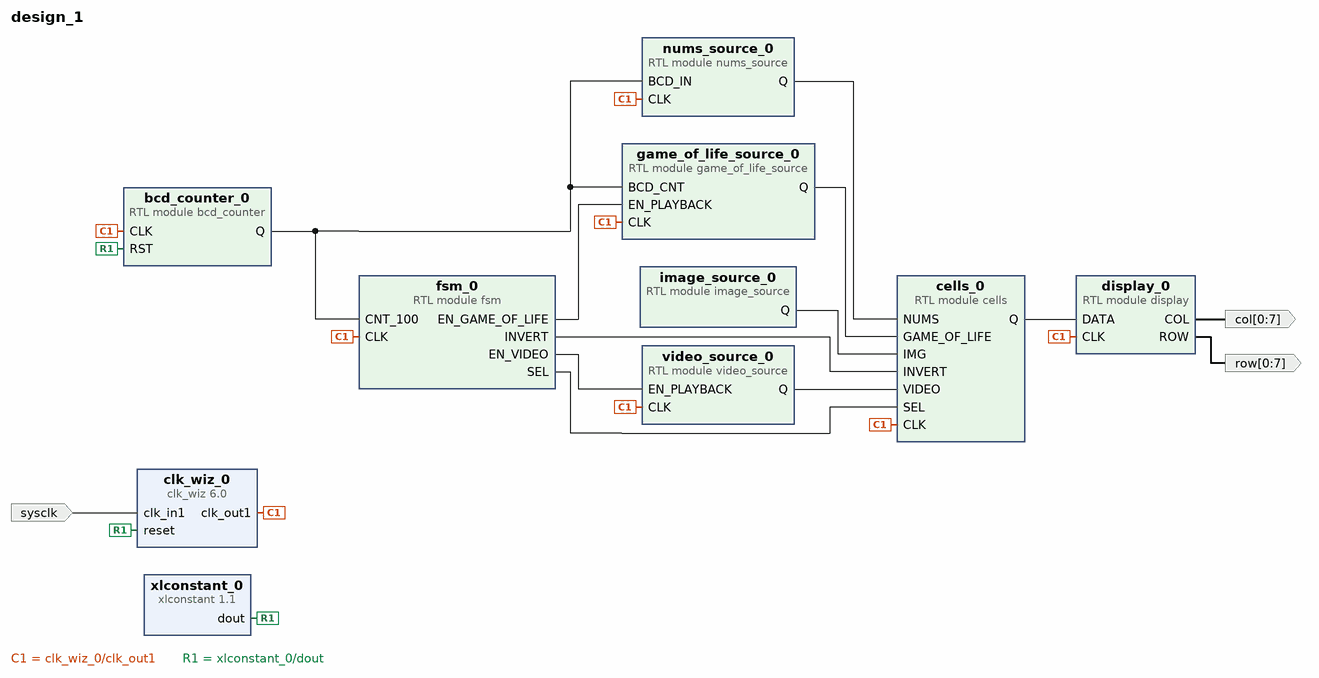
[diagram p0: block diagram of the top level]
# Vivado block design design_1, xc7z020clg400-1, Vivado 2023.2.2
create_bd_design design_1

create_bd_port -dir O -from 0 -to 7 row
create_bd_port -dir O -from 0 -to 7 col
create_bd_port -dir I -type clk sysclk
set_property -dict {CONFIG.FREQ_HZ 20000000} [get_bd_ports sysclk]

create_bd_cell -type ip -vlnv xilinx.com:ip:clk_wiz:6.0 clk_wiz_0
set_property -dict [list \
  CONFIG.CLKIN1_JITTER_PS 500.0 \
  CONFIG.CLKOUT1_JITTER 353.847 \
  CONFIG.CLKOUT1_PHASE_ERROR 301.005 \
  CONFIG.CLKOUT1_REQUESTED_OUT_FREQ 25.00 \
  CONFIG.MMCM_CLKFBOUT_MULT_F 50.000 \
  CONFIG.MMCM_CLKIN1_PERIOD 50.000 \
  CONFIG.MMCM_CLKIN2_PERIOD 10.0 \
  CONFIG.MMCM_CLKOUT0_DIVIDE_F 40.000 \
  CONFIG.PRIM_IN_FREQ 20.00 \
] [get_bd_cells clk_wiz_0]
create_bd_cell -type module -reference display display_0
create_bd_cell -type module -reference cells cells_0
create_bd_cell -type module -reference fsm fsm_0
create_bd_cell -type module -reference bcd_counter bcd_counter_0
create_bd_cell -type module -reference image_source image_source_0
create_bd_cell -type module -reference nums_source nums_source_0
create_bd_cell -type module -reference video_source video_source_0
create_bd_cell -type ip -vlnv xilinx.com:ip:xlconstant:1.1 xlconstant_0
set_property -dict {CONFIG.CONST_VAL 0} [get_bd_cells xlconstant_0]
create_bd_cell -type module -reference game_of_life_source game_of_life_source_0

# ---- connections ----

connect_bd_net [get_bd_pins bcd_counter_0/Q] \
  [get_bd_pins nums_source_0/BCD_IN] [get_bd_pins game_of_life_source_0/BCD_CNT] [get_bd_pins fsm_0/CNT_100]
connect_bd_net [get_bd_pins cells_0/Q] [get_bd_pins display_0/DATA]
connect_bd_net -net clk_in1_0_1 [get_bd_ports sysclk] [get_bd_pins clk_wiz_0/clk_in1]
connect_bd_net [get_bd_pins clk_wiz_0/clk_out1] \
  [get_bd_pins display_0/CLK] [get_bd_pins nums_source_0/CLK] [get_bd_pins video_source_0/CLK] [get_bd_pins cells_0/CLK] \
  [get_bd_pins bcd_counter_0/CLK] [get_bd_pins game_of_life_source_0/CLK] [get_bd_pins fsm_0/CLK]
connect_bd_net [get_bd_pins display_0/COL] [get_bd_ports col]
connect_bd_net [get_bd_pins display_0/ROW] [get_bd_ports row]
connect_bd_net [get_bd_pins fsm_0/EN_GAME_OF_LIFE] [get_bd_pins game_of_life_source_0/EN_PLAYBACK]
connect_bd_net [get_bd_pins fsm_0/EN_VIDEO] [get_bd_pins video_source_0/EN_PLAYBACK]
connect_bd_net [get_bd_pins fsm_0/INVERT] [get_bd_pins cells_0/INVERT]
connect_bd_net [get_bd_pins fsm_0/SEL] [get_bd_pins cells_0/SEL]
connect_bd_net [get_bd_pins game_of_life_source_0/Q] [get_bd_pins cells_0/GAME_OF_LIFE]
connect_bd_net [get_bd_pins image_source_0/Q] [get_bd_pins cells_0/IMG]
connect_bd_net [get_bd_pins nums_source_0/Q] [get_bd_pins cells_0/NUMS]
connect_bd_net [get_bd_pins video_source_0/Q] [get_bd_pins cells_0/VIDEO]
connect_bd_net [get_bd_pins xlconstant_0/dout] [get_bd_pins clk_wiz_0/reset] [get_bd_pins bcd_counter_0/RST]

validate_bd_design
save_bd_design
